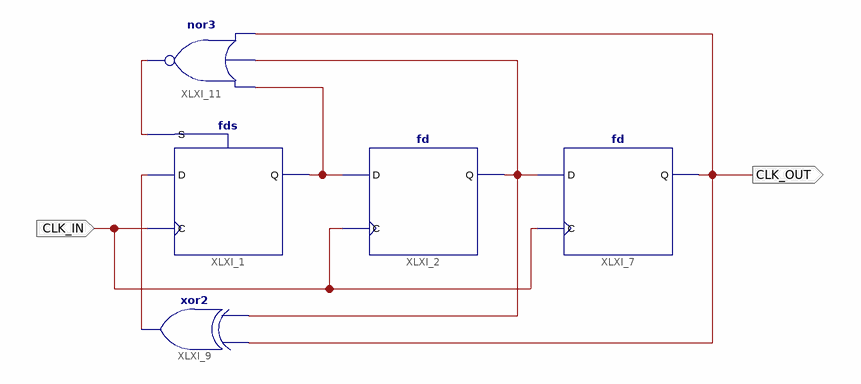
[diagram p0: schematic sheet 1]
// Xilinx ISE schematic LFSR3Bit.sch (spartan6) as structural Verilog: 5 symbols, 2 ports
module LFSR3Bit (
  input  CLK_IN,
  output CLK_OUT
);

  wire XLXN_6, XLXN_8, XLXN_12, XLXN_13;

  fds XLXI_1 (.C(CLK_IN), .D(XLXN_6), .S(XLXN_12), .Q(XLXN_8));
  fd XLXI_2 (.C(CLK_IN), .D(XLXN_8), .Q(XLXN_13));
  fd XLXI_7 (.C(CLK_IN), .D(XLXN_13), .Q(CLK_OUT));
  xor XLXI_9 (XLXN_6, XLXN_13, CLK_OUT);
  nor XLXI_11 (XLXN_12, CLK_OUT, XLXN_13, XLXN_8);
endmodule
